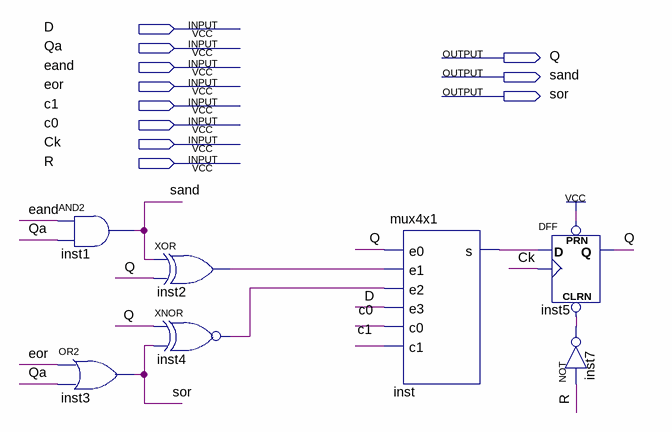
[diagram p0: schematic sheet]
// Quartus schematic generic_counter.bdf as structural Verilog: 7 symbols, 11 pins
module generic_counter (
  input  D,
  input  Qa,
  input  eand,
  input  eor,
  input  c1,
  input  c0,
  input  Ck,
  input  R,
  output Q,
  output sand,
  output sor
);

  wire inst2_out, inst4_out, inst7_out, inst_s;

  and inst1 (sand, eand, Qa);
  or inst3 (sor, eor, Qa);
  xor inst2 (inst2_out, sand, Q);
  xnor inst4 (inst4_out, Q, sor);
  mux4x1 inst (.e0(Q), .e1(inst2_out), .e2(inst4_out), .e3(D), .c0(c0), .c1(c1), .s(inst_s));
  DFF inst5 (.CLRN(inst7_out), .CLK(Ck), .D(inst_s), .PRN(1'b1), .Q(Q));
  not inst7 (inst7_out, R);
endmodule
